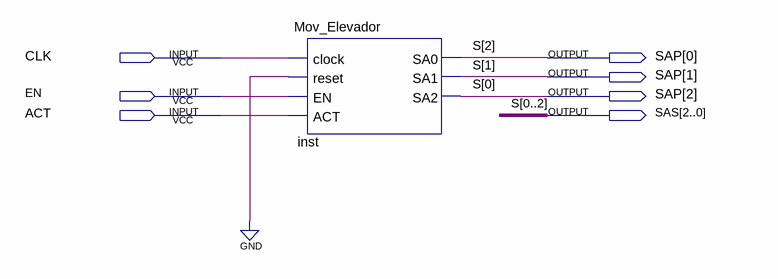
[diagram p0: schematic sheet]
// Quartus schematic Elevador_Movimento.bdf as structural Verilog: 1 symbols, 7 pins
module Elevador_Movimento (
  input  CLK,
  input  EN,
  input  ACT,
  output [2:0] SAP,
  output [2:0] SAS
);

  Mov_Elevador inst (.clock(CLK), .reset(1'b0), .EN(EN), .ACT(ACT), .SA0(SAP[0]), .SA1(SAP[1]), .SA2(SAP[2]));

  assign SAS = SAP;

  // Other names for the same wires on the sheet: S[2:0] = {SAP[0], SAP[1], SAP[2]}
endmodule
